# EAGLE design Final188 (EAGLE 9.6.2)
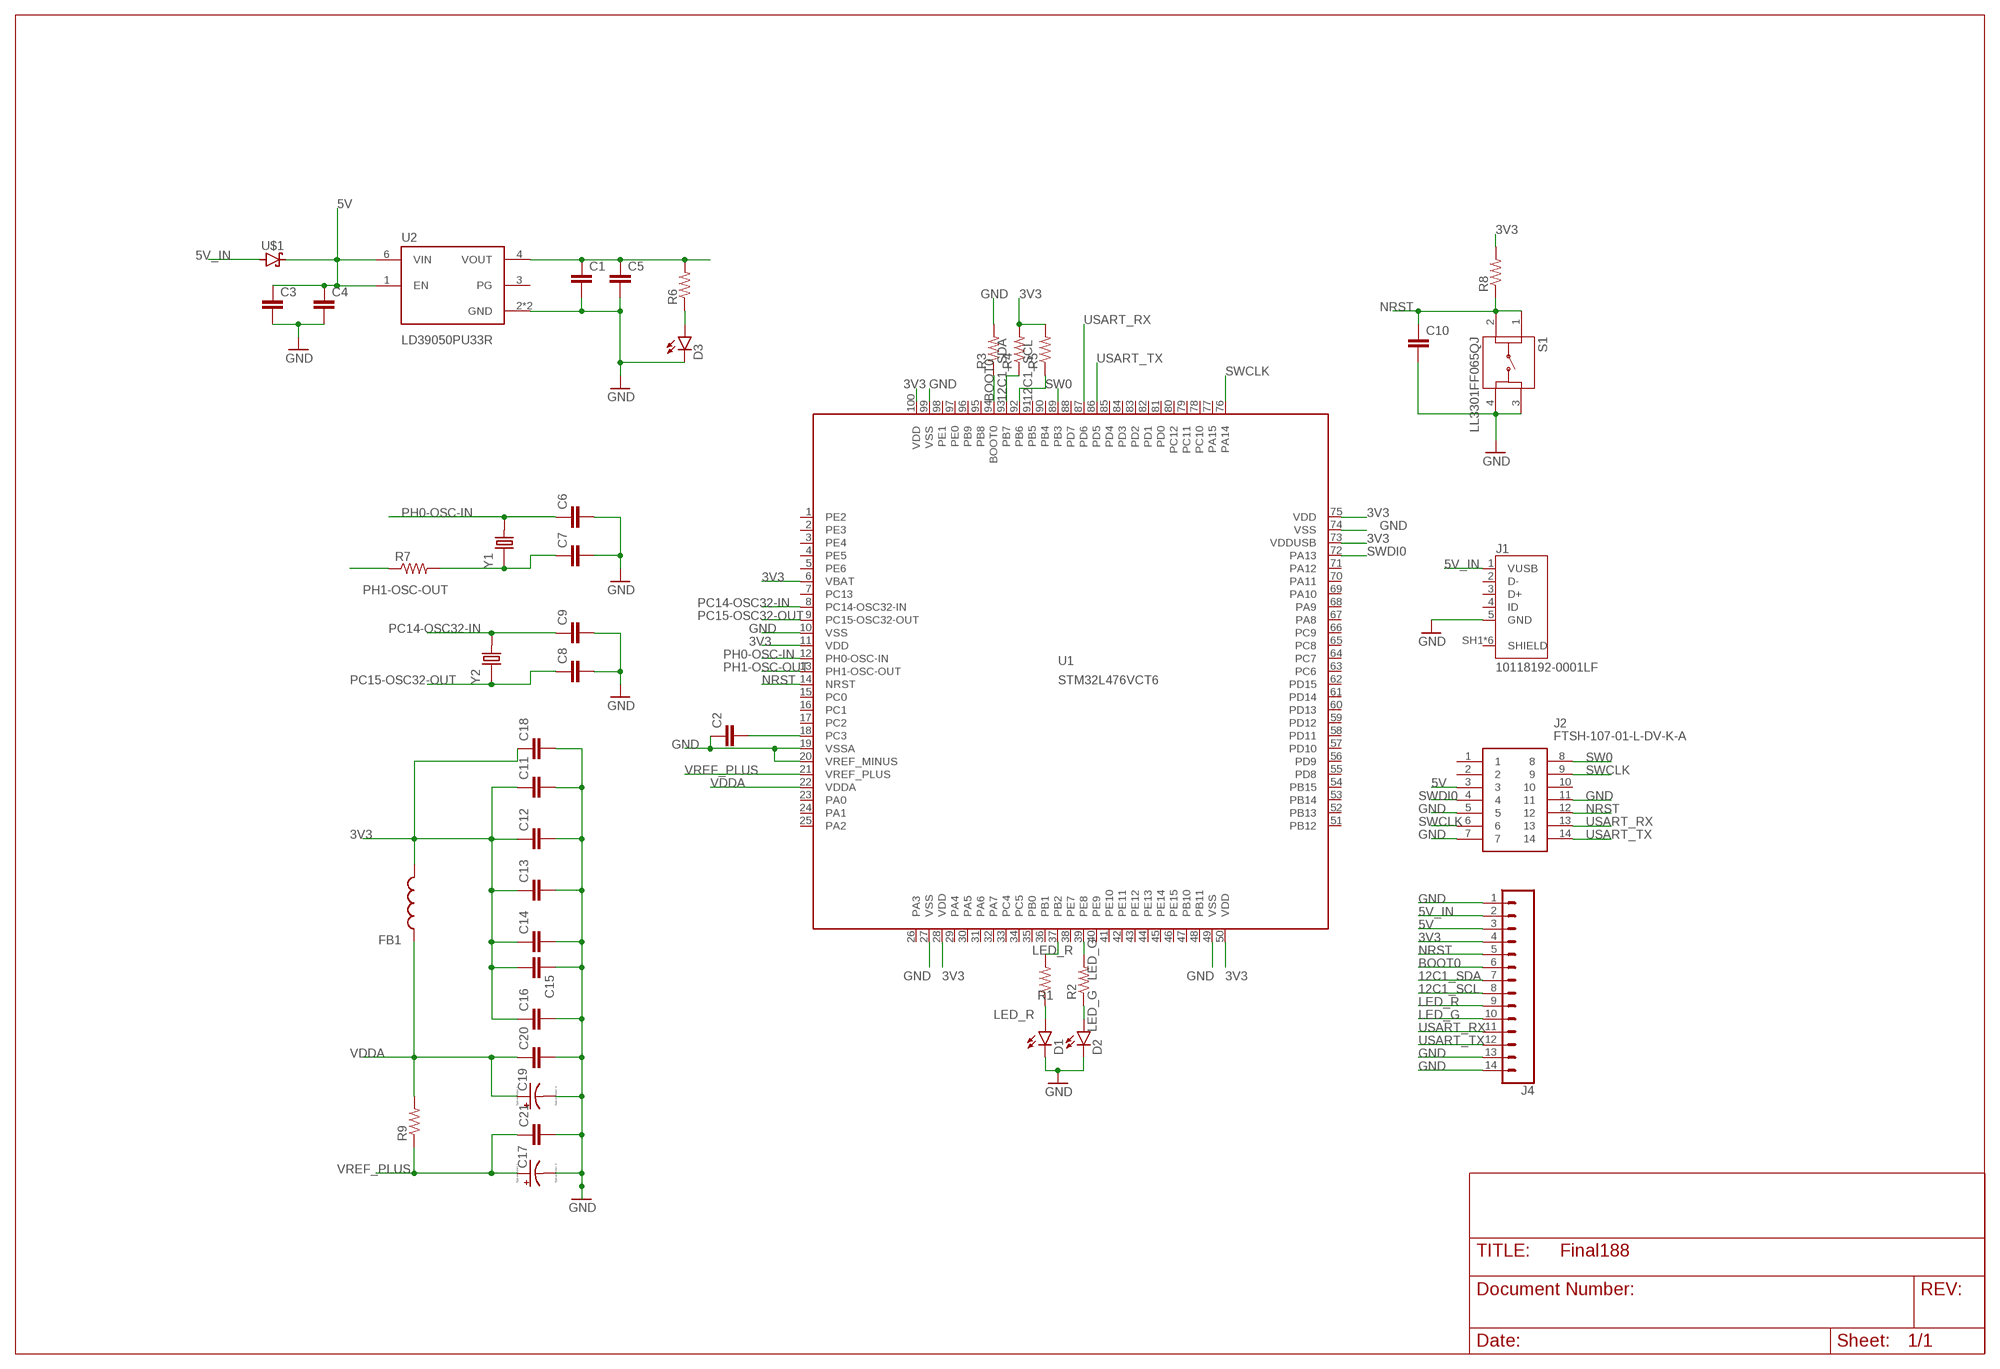
[diagram p0: schematic, sheet 1]

## Parts
C1  CC0603KRX5R7BB105  [CAPC1608X90]
C2  CC0603KRX5R7BB105  [CAPC1608X90]
C3  CC0603KRX5R7BB105  [CAPC1608X90]
C4  CC0402KRX7R7BB104  [CAPC1005X55N]
C5  CC0402KRX7R7BB104  [CAPC1005X55N]
C6  CC0402JRNPO9BN200  [CAPC1005X55N]
C7  CC0402JRNPO9BN200  [CAPC1005X55N]
C8  CC0402CRNPO9BN4R7  [CAPC1005X55N]
C9  CC0402CRNPO9BN4R7  [CAPC1005X55N]
C10  CC0402KRX7R7BB104  [CAPC1005X55N]
C11  CC0402KRX7R7BB104  [CAPC1005X55N]
C12  CC0402KRX7R7BB104  [CAPC1005X55N]
C13  CC0402KRX7R7BB104  [CAPC1005X55N]
C14  CC0402KRX7R7BB104  [CAPC1005X55N]
C15  CC0402KRX7R7BB104  [CAPC1005X55N]
C16  CC0402KRX7R7BB104  [CAPC1005X55N]
C17  TAJA105K016RNJ  [CAPPM3216X180N]
C18  CC0402KRX7R7BB104  [CAPC1005X55N]
C19  TAJA105K016RNJ  [CAPPM3216X180N]
C20  CC0402KRX7R7BB104  [CAPC1005X55N]
C21  CC0402KRX7R7BB104  [CAPC1005X55N]
D1  SML-P12MTT86  [LED_SML-P11UTT86R]
D2  SML-P12MTT86  [LED_SML-P11UTT86R]
D3  SML-P12VTT86  [LED_SML-P11UTT86R]
FB1  BK1608HS601-T  [BEADC1608X95N]
J1  10118192-0001LF  [AMPHENOL_10118192-0001LF]
J2  FTSH-107-01-L-DV-K-A  [FTSH10701LDVKA]
J4  CONN_14  [1X14]
R1  RC0402FR-071KL  [RESC1005X40N]
R2  RC0402FR-071KL  [RESC1005X40N]
R3  RC0402FR-071KL  [RESC1005X40N]
R4  RC0402FR-071KL  [RESC1005X40N]
R5  RC0402FR-071KL  [RESC1005X40N]
R6  RC0402FR-071KL  [RESC1005X40N]
R7  RC0402FR-071KL  [RESC1005X40N]
R8  RC0402FR-0710KL  [RESC1005X40N]
R9  RT0402FRE07220RL  [RESC1005X35N]
S1  LL3301FF065QJ  [LL3301FF065QJ]
U1  STM32L476VCT6  [LQFP100_14X14]
U2  LD39050PU33R  [SON95P300X300X100-7N]
U$1  STPS1L30A  [DIOM5226X223N]
Y1  ABLS-8.000MHZ-B2-T  [XTAL_ABLS-8.000MHZ-B2-T]
Y2  ECS-.327-12.5-12QS-TR  [XTAL_ECS-.327-12.5-12QS-TR]

## Nets
3V3: C11.1 C12.1 C13.1 C14.1 C15.2 C16.1 C18.1 FB1.2 J4.4 R4.2 R5.2 R8.2 U1.6(VBAT) U1.11(VDD) U1.28(VDD) U1.50(VDD) U1.73(VDDUSB) U1.75(VDD) U1.100(VDD)
5V: C3.1 C4.1 J2.3 J4.3 U2.1(EN) U2.6(VIN) U$1.1(C)
5V_IN: J1.1(VUSB) J4.2 U$1.2(A)
12C1_SCL: J4.8 R5.1 U1.92(PB6)
12C1_SDA: J4.7 R4.1 U1.93(PB7)
BOOT0: J4.6 R3.1 U1.94(BOOT0)
GND: C1.2 C2.1 C3.2 C4.2 C5.2 C6.2 C7.2 C8.2 C9.2 C10.2 C11.2 C12.2 C13.2 C14.2 C15.1 C16.2 C17.C(-) C18.2 C19.C(-) C20.2 C21.2 D1.C D2.C D3.C J1.5(GND) J2.5 J2.7 J2.11 J4.1 J4.13 J4.14 R3.2 S1.3 S1.4 U1.10(VSS) U1.19(VSSA) U1.20(VREF_MINUS) U1.27(VSS) U1.49(VSS) U1.74(VSS) U1.99(VSS) U2.2(GND) U2.7(GND)
LED_G: D2.A J4.10 R2.1 R2.2 U1.39(PE8)
LED_R: D1.A J4.9 R1.1 R1.2 U1.37(PB2)
N$8: C2.2 U1.18(PC3)
N$9: C1.1 C5.1 R6.2 U2.4(VOUT)
N$10: C7.1 R7.2 Y1.1
N$11: D3.A R6.1
NRST: C10.1 J2.12 J4.5 R8.1 S1.1 S1.2 U1.14(NRST)
PC14-OSC32-IN: C9.1 U1.8(PC14-OSC32-IN) Y2.2
PC15-OSC32-OUT: C8.1 U1.9(PC15-OSC32-OUT) Y2.1
PH0-OSC-IN: C6.1 U1.12(PH0-OSC-IN) Y1.2
PH1-OSC-OUT: R7.1 U1.13(PH1-OSC-OUT)
SW0: J2.8 U1.89(PB3)
SWCLK: J2.6 J2.9 U1.76(PA14)
SWDI0: J2.4 U1.72(PA13)
USART_RX: J2.13 J4.11 U1.87(PD6)
USART_TX: J2.14 J4.12 U1.86(PD5)
VDDA: C19.A(+) C20.1 FB1.1 R9.2 U1.22(VDDA)
VREF_PLUS: C17.A(+) C21.1 R9.1 U1.21(VREF_PLUS)
Unconnected: J1.2(D-) J1.3(D+) J1.4(ID) J1.SH1(SHIELD) J1.SH2(SHIELD) J1.SH3(SHIELD) J1.SH4(SHIELD) J1.SH5(SHIELD) J1.SH6(SHIELD) J2.1 J2.2 J2.10 U1.1(PE2) U1.2(PE3) U1.3(PE4) U1.4(PE5) U1.5(PE6) U1.7(PC13) U1.15(PC0) U1.16(PC1) U1.17(PC2) U1.23(PA0) U1.24(PA1) U1.25(PA2) U1.26(PA3) U1.29(PA4) U1.30(PA5) U1.31(PA6) U1.32(PA7) U1.33(PC4) U1.34(PC5) U1.35(PB0) U1.36(PB1) U1.38(PE7) U1.40(PE9) U1.41(PE10) U1.42(PE11) U1.43(PE12) U1.44(PE13) U1.45(PE14) U1.46(PE15) U1.47(PB10) U1.48(PB11) U1.51(PB12) U1.52(PB13) U1.53(PB14) U1.54(PB15) U1.55(PD8) U1.56(PD9) U1.57(PD10) U1.58(PD11) U1.59(PD12) U1.60(PD13) U1.61(PD14) U1.62(PD15) U1.63(PC6) U1.64(PC7) U1.65(PC8) U1.66(PC9) U1.67(PA8) U1.68(PA9) U1.69(PA10) U1.70(PA11) U1.71(PA12) U1.77(PA15) U1.78(PC10) U1.79(PC11) U1.80(PC12) U1.81(PD0) U1.82(PD1) U1.83(PD2) U1.84(PD3) U1.85(PD4) U1.88(PD7) U1.90(PB4) U1.91(PB5) U1.95(PB8) U1.96(PB9) U1.97(PE0) U1.98(PE1) U2.3(PG)

## Library data of the parts
C1-C3 = ce-capstone:CC0603KRX5R7BB105: CAPACITOR CERAMIC, 1µF, 10V, X5R, 0603; Dielectric Characteristic:X5R; Capacitance:1µF; Capacitance Tolerance:± 10%; Voltage Rating:16V; Temperature Coefficient:± 15%; Capacitor Case Style:0603; No. of Pins:2; Mounting Type:SMD ;RoHS Compliant: Yes; DESCRIPTION: 1µF ±10% 16V Ceramic Capacitor X5R 0603 _1608 Metric_; DIGI-KEY_PART_NUMBER: 311-1444-1-ND; DIGI-KEY_PURCHASE_URL: https://www.digikey.com/product-detail/en/yageo/CC0603KRX5R7BB105/311-1444-1-ND/2833750?utm_source=snapeda&utm_medium=aggregator&utm_campaign=symbol; MF: Yageo; MP: CC0603KRX5R7BB105; PACKAGE: 0603 Yageo
C4 C5 C10-C16 C18 C20 C21 = ce-capstone:CC0402KRX7R7BB104: .1UF 16V 10% 0402; DESCRIPTION: 0.1µF ±10% 16V Ceramic Capacitor X7R 0402 _1005 Metric_; DIGI-KEY_PART_NUMBER: 311-1338-1-ND; DIGI-KEY_PURCHASE_URL: https://www.digikey.com/product-detail/en/yageo/CC0402KRX7R7BB104/311-1338-1-ND/2103122?utm_source=snapeda&utm_medium=aggregator&utm_campaign=symbol; MF: Yageo; MP: CC0402KRX7R7BB104; PACKAGE: 0402 Yageo
C6 C7 = ce-capstone:CC0402JRNPO9BN200: CAPACITOR CERAMIC 20PF 50V, C0G, 0402; Dielectric Characteristic:C0G / NP0; Capacitance:20pF; Capacitance Tolerance:± 5%; Voltage Rating:50V; Capacitor Case Style:0402; Capacitor Mounting:SMD; DESCRIPTION: 20pF ±5% 50V Ceramic Capacitor C0G, NP0 0402 _1005 Metric_; DIGI-KEY_PART_NUMBER: 311-1417-1-ND; DIGI-KEY_PURCHASE_URL: https://www.digikey.com/product-detail/en/yageo/CC0402JRNPO9BN200/311-1417-1-ND/2833723?utm_source=snapeda&utm_medium=aggregator&utm_campaign=symbol; MF: Yageo; MP: CC0402JRNPO9BN200; PACKAGE: 0402 Yageo
C8 C9 = ce-capstone:CC0402CRNPO9BN4R7: 0402 4.7 pF 50 V ±0.25 pF Tolerance NP0 SMT Multilayer Ceramic Capacitor; DESCRIPTION: 4.7pF ±0.25pF 50V Ceramic Capacitor C0G, NP0 0402 _1005 Metric_; DIGI-KEY_PART_NUMBER: 311-1367-1-ND; DIGI-KEY_PURCHASE_URL: https://www.digikey.com/product-detail/en/yageo/CC0402CRNPO9BN4R7/311-1367-1-ND/2103151?utm_source=snapeda&utm_medium=aggregator&utm_campaign=symbol; MF: Yageo; MP: CC0402CRNPO9BN4R7; PACKAGE: 0402 Yageo
C17 C19 = ce-capstone:TAJA105K016RNJ: Capacitor tantalum TAJ 1206 1uF 16V AVX 1uF SMD Solid MnO2 Tantalum Electrolytic Capacitor, 16 V dc +/-10%, TAJ Series Source: Datasheet <http://www.farnell.com/datasheets/1680476.pdf>; ALLIED_NUMBER: 70474975; ALLIED_PRICE-STOCK: https://www.alliedelec.com/avx-taja105k016r/70474975/; DESCRIPTION: Capacitor tantalum TAJ 1206 1uF 16V AVX 1uF SMD Solid MnO2 Tantalum Electrolytic Capacitor, 16 V dc +/-10%, TAJ Series; HEIGHT: 1.8mm; MANUFACTURER_NAME: AVX; MANUFACTURER_PART_NUMBER: TAJA105K016RNJ; MOUSER_PART_NUMBER: 581-TAJA105K016RNJ; MOUSER_PRICE-STOCK: https://www.mouser.com/Search/Refine.aspx?Keyword=581-TAJA105K016R; RS_PART_NUMBER: 6992804P; RS_PRICE-STOCK: http://uk.rs-online.com/web/p/products/6992804P
D1 D2 = ce-capstone:SML-P12MTT86: SML-P1 Series Red 0402 Clear 60 mcd 2 V Surface Mount PICOLED LED; AVAILABILITY: Unavailable; DESCRIPTION: Green 572nm LED Indication - Discrete 2V 0402 _1006 Metric_; MF: Rohm; MP: SML-P12MTT86; PACKAGE: 0402 Rohm; PRICE: None
D3 = ce-capstone:SML-P12VTT86: SML-P1 Series Red 0402 Clear 60 mcd 2 V Surface Mount PICOLED LED; AVAILABILITY: Unavailable; DESCRIPTION: Red 630nm LED Indication - Discrete 2V 0402 _1006 Metric_; MF: Rohm; MP: SML-P12VTT86; PACKAGE: 0402 Rohm; PRICE: None
FB1 = ce-capstone:BK1608HS601-T: Ferrite Chip Bead(Lead Free) Source: Datasheet <https://www.tai-tech.com.tw/_upload/files/FCM1608-Series.pdf>; DESCRIPTION: Ferrite Chip Bead(Lead Free); HEIGHT: 0.95mm; MANUFACTURER_NAME: Taiyo Yuden; MANUFACTURER_PART_NUMBER: BK1608HS601-T
J1 = ce-capstone:10118192-0001LF: Single Port 5 Contact Horizontal Right Angle Shielded Micro B USB 2.0 Connector; AVAILABILITY: Unavailable; DESCRIPTION: USB - micro B USB 2.0 Receptacle Connector 5 Position Surface Mount, Right Angle; MF: Amphenol ICC; MP: 10118192-0001LF; PACKAGE: None; PRICE: None
J2 = ce-capstone:FTSH-107-01-L-DV-K-A: Headers & Wire Housings .050" Micro Terminal Strip Source: Datasheet <http://suddendocs.samtec.com/prints/ftsh-1xx-xx-xxx-dv-xxx-xxx-mkt.pdf>; DESCRIPTION: Headers & Wire Housings .050" Micro Terminal Strip; HEIGHT: 5.97mm; MANUFACTURER_NAME: SAMTEC; MANUFACTURER_PART_NUMBER: FTSH-107-01-L-DV-K-A; MOUSER_PART_NUMBER: 200-FTSH10701LDVKA; MOUSER_PRICE-STOCK: https://www.mouser.com/Search/Refine.aspx?Keyword=200-FTSH10701LDVKA
J4 = SparkFun-Connectors:CONN_14: Multi connection point. Often used as Generic Header-pin footprint for 0.1 inch spaced/style header connections On any of the 0.1 inch spaced packages, you can populate with these: Break Away Headers - Straight <https://www.sparkfun.com/products/116> (PRT-00116) Break Away Male Headers - Right Angle <https://www.sparkfun.com/products/553> (PRT-00553) Female Headers <https://www.sparkfun.com/products/115> (PRT-00115) Break Away Headers - Machine Pin <https://www.sparkfun.com/products/117> (PRT-00117) Break Away Female Headers - Swiss Machine Pin <https://www.sparkfun.com/products/743> (PRT-00743) For SCREWTERMINALS and SPRING TERMINALS visit here: Screw Terimnals on SparkFun.com <https://www.sparkfun.com/search/results?term=Screw+Terminals> (5mm/3.5mm/2.54mm spacing) This device is also useful as a general connection point to wire up your design to another part of your project. Our various solder wires solder well into these plated through hole pads. Hook-Up Wire - Assortment (Stranded, 22 AWG) <https://www.sparkfun.com/products/11375> (PRT-11375) Hook-Up Wire - Assortment (Solid Core, 22 AWG) <https://www.sparkfun.com/products/11367> (PRT-11367) View the entire wire category on our website here <https://www.sparkfun.com/categories/141> Special notes: Molex polarized connector foot print use with SKU : PRT-08231 with associated crimp pins and housings. 1MM SMD Version SKU: PRT-10208 NOTES ON THE VARIANTS LOCK and LOCK_LONGPADS... This footprint was designed to help hold the alignment of a through-hole component (i.e. 6-pin header) while soldering it into place. You may notice that each hole has been shifted either up or down by 0.005 of an inch from it's more standard position (which is a perfectly straight line). This slight alteration caused the pins (the squares in the middle) to touch the edges of the holes. Because they are alternating, it causes a "brace" to hold the component in place. 0.005 has proven to be the perfect amount of "off-center" position when using our standard breakaway headers. Although looks a little odd when you look at the bare footprint, once you have a header in there, the alteration is very hard to notice. Also,if you push a header all the way into place, it is covered up entirely on the bottom side.
R1-R7 = ce-capstone:RC0402FR-071KL: RES SMD 510 OHM 1% 1/16W 0402; DESCRIPTION: 510 Ohms ±1% 0.063W, 1/16W Chip Resistor 0402 _1005 Metric_ Moisture Resistant Thick Film; DIGI-KEY_PART_NUMBER: 311-510LRCT-ND; DIGI-KEY_PURCHASE_URL: https://www.digikey.com/product-detail/en/yageo/RC0402FR-07510RL/311-510LRCT-ND/729579?utm_source=snapeda&utm_medium=aggregator&utm_campaign=symbol; MF: Yageo; MP: RC0402FR-07510RL; PACKAGE: 1005 Panasonic Electronic Components
R8 = ce-capstone:RC0402FR-0710KL: RES SMD 510 OHM 1% 1/16W 0402; DESCRIPTION: 510 Ohms ±1% 0.063W, 1/16W Chip Resistor 0402 _1005 Metric_ Moisture Resistant Thick Film; DIGI-KEY_PART_NUMBER: 311-510LRCT-ND; DIGI-KEY_PURCHASE_URL: https://www.digikey.com/product-detail/en/yageo/RC0402FR-07510RL/311-510LRCT-ND/729579?utm_source=snapeda&utm_medium=aggregator&utm_campaign=symbol; MF: Yageo; MP: RC0402FR-07510RL; PACKAGE: 1005 Panasonic Electronic Components
R9 = ce-capstone:RT0402FRE07220RL: RES SMD 4.7K OHM 1% 1/16W 0402; DESCRIPTION: 4.7 kOhms ±1% 0.063W, 1/16W Chip Resistor 0402 _1005 Metric_ Thin Film; DIGI-KEY_PART_NUMBER: YAG3347CT-ND; DIGI-KEY_PURCHASE_URL: https://www.digikey.com/product-detail/en/yageo/RT0402FRE074K7L/YAG3347CT-ND/5418052?utm_source=snapeda&utm_medium=aggregator&utm_campaign=symbol; MF: Yageo; MP: RT0402FRE074K7L; PACKAGE: 1005 Yageo
S1 = ce-capstone:LL3301FF065QJ: Pushbutton Switches 50mA 12VDC F065 7.0mm J-Lead Source: Datasheet <https://componentsearchengine.com/Datasheets/1/LL3301FF065QJ.pdf>; DESCRIPTION: Pushbutton Switches 50mA 12VDC F065 7.0mm J-Lead; HEIGHT: 7.3mm; MANUFACTURER_NAME: E-Switch; MANUFACTURER_PART_NUMBER: LL3301FF065QJ; MOUSER_PART_NUMBER: 612-LL3301FF065QJ; MOUSER_PRICE-STOCK: https://www.mouser.com/Search/Refine.aspx?Keyword=612-LL3301FF065QJ
U1 = ce-capstone:STM32L476V*: STM32L476VX LQFP100 Datasheet STM32L476XX <http://www.st.com/content/ccc/resource/technical/document/datasheet/c5/ed/2f/60/aa/79/42/0b/DM00108832.pdf/files/DM00108832.pdf/jcr:content/translations/en.DM00108832.pdf>; FARNELL: 2518171; FLASH: 256kB; SRAM: 128kB
U2 = ce-capstone:LD39050PU33R: LD39050 Series 500 mA 3.3 V Fixed Low Noise LDO Voltage Regulator - DFN-6; AVAILABILITY: Unavailable; DESCRIPTION: Linear Voltage Regulator IC 1 Output 500mA 6-DFN _3x3_; MF: STMicroelectronics; MP: LD39050PU33R; PACKAGE: DFN-6 STMicroelectronics; PRICE: None
U$1 = ce-capstone:STPS1L30A
Y1 = ce-capstone:ABLS-8.000MHZ-B2-T: Crystal 8MHz Â±20ppm (Tol) Â±50ppm (Stability) 18pF FUND 80Ohm 2-Pin HC-49/US SMD T/R; AVAILABILITY: Unavailable; DESCRIPTION: 8MHz ±20ppm Crystal 18pF 80 Ohms HC-49/US; MF: Abracon LLC; MP: ABLS-8.000MHZ-B2; PACKAGE: HC-49/US Abracon LLC; PRICE: None
Y2 = ce-capstone:ECS-.327-12.5-12QS-TR: SMD CRYSTAL 32.768 KHz; AVAILABILITY: Unavailable; DESCRIPTION: 32.768kHz ±20ppm Crystal 12.5pF 90 kOhms 2-SMD, No Lead; MF: ECS Inc.; MP: ECS-.327-12.5-12QS-TR; PACKAGE: SMD-2 ECS International; PRICE: None

## Board
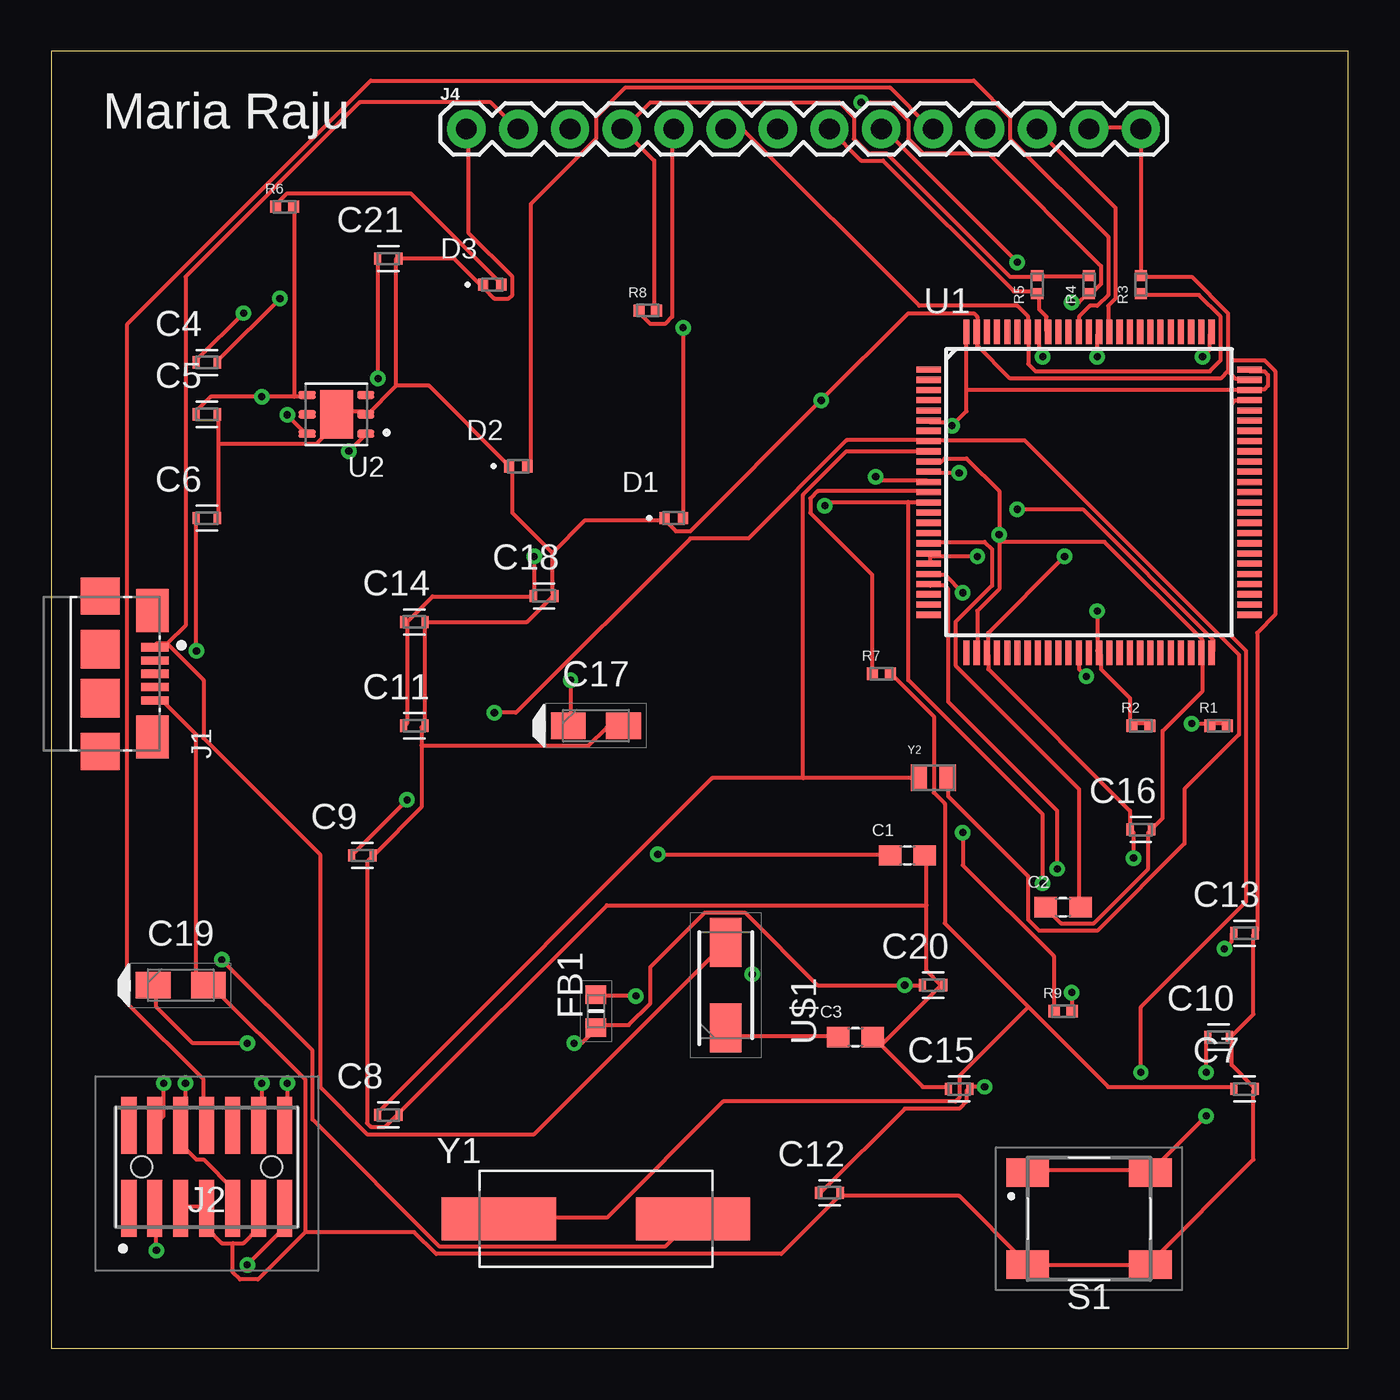
[diagram p1: board, top side]
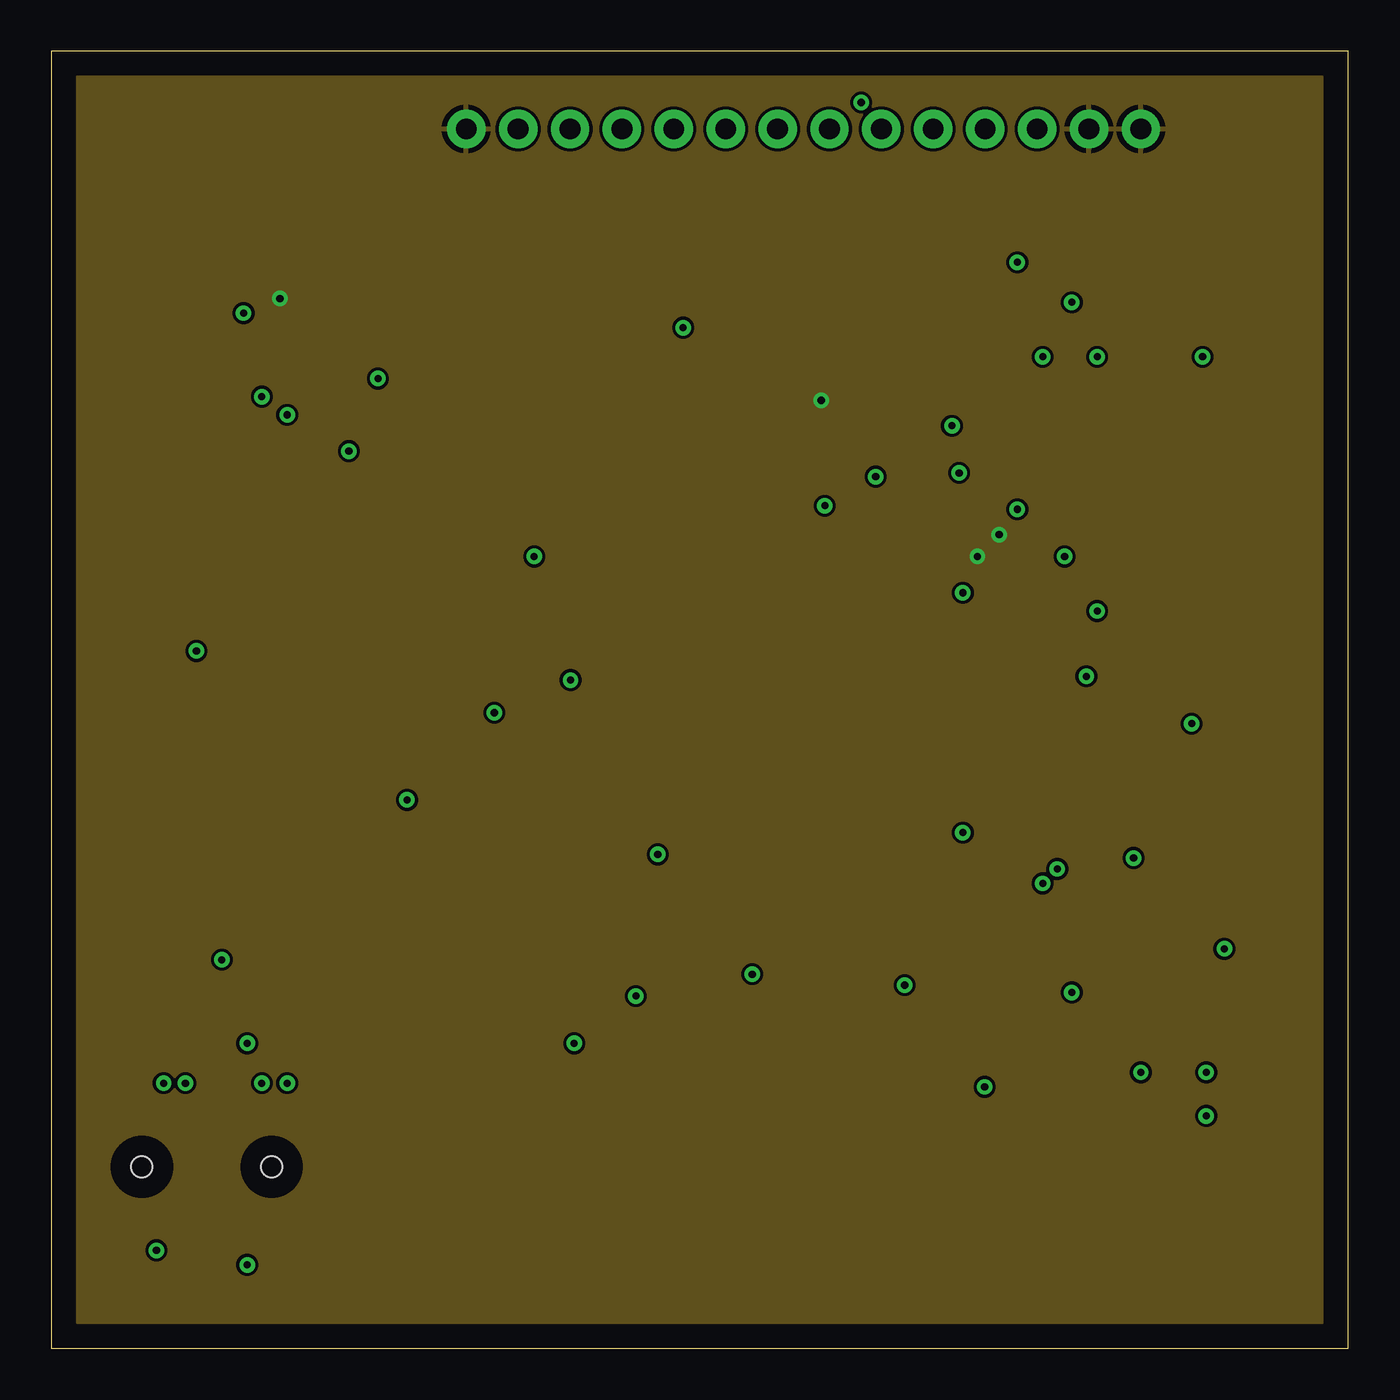
[diagram p2: board, inner layer Route2]
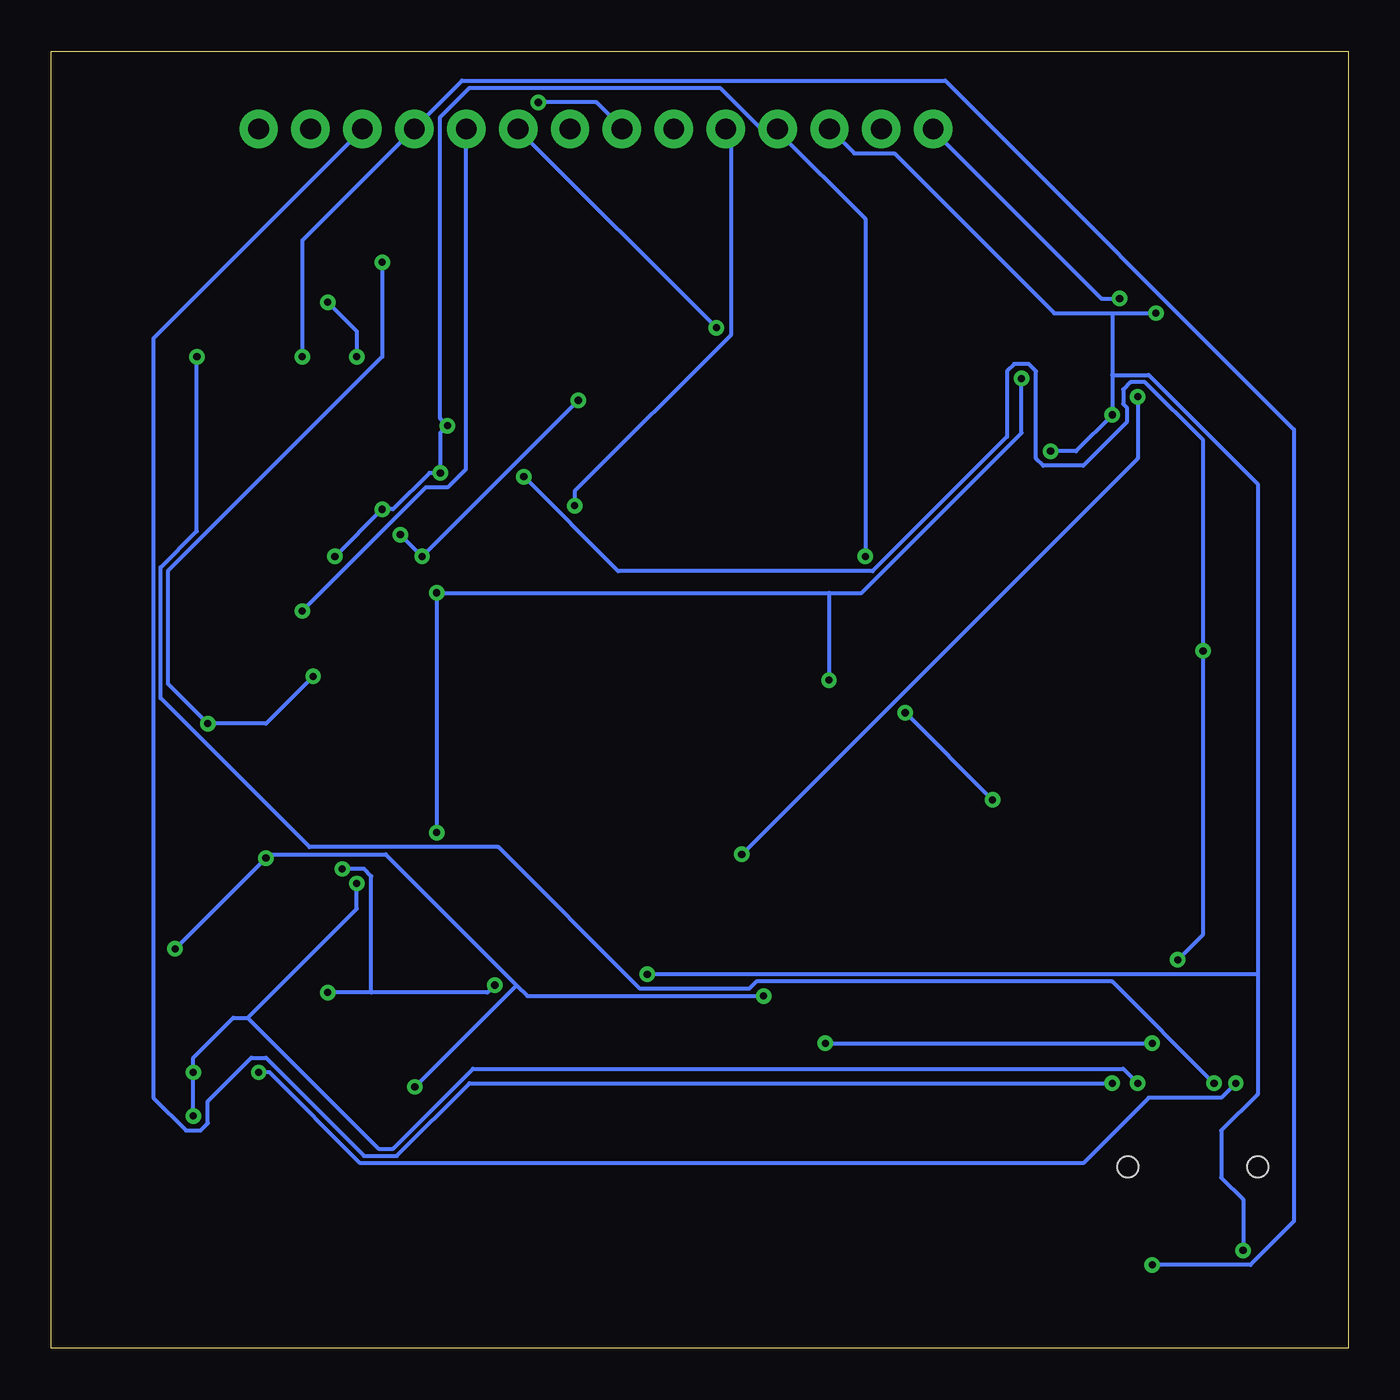
[diagram p3: board, bottom side, seen from below]

Size 63.5 x 63.5 mm. Coordinates in mm from the lower left corner, seen from the top.
Outline: 0,0 63.5,0 63.5,63.5 0,63.5 0,0
Copper layers (1+2*15+16): Top 0.035mm / dielectric 1.5mm / Route2 0.035mm / dielectric 0.15mm / Route15 0.035mm / dielectric 0.2mm / Bottom 0.035mm
Design rules "default *": minimum track width 8mil, minimum drill 0.35mm, track to track 6mil, track to pad 6mil, pad to pad 6mil, via to via 6mil, smd to smd 6mil, copper to edge 40mil, drill to drill 6mil, minimum pad ring 10mil, minimum via ring 8mil, stop-mask expansion 4mil, vias tented up to drill 0mil, thermal gap 10mil

### Footprints (pad centres in the part's own frame; a part is rotated, then mirrored left to right if it is on the bottom)
CAPC1608X90 = smd 1.1 x 1: 1 -0.85,0; 2 0.85,0
CAPC1005X55N = smd 0.35 x 0.6: 1 -0.525,0; 2 0.525,0
CAPPM3216X180N = smd 1.7 x 1.3: A -1.35,0; C 1.35,0
LED_SML-P11UTT86R = smd 0.5 x 0.6: A 0.45,0; C -0.45,0
BEADC1608X95N = smd 0.9 x 1: 1 -0.8,0; 2 0.8,0
AMPHENOL_10118192-0001LF = smd 0.4 x 1.35: 1 -1.3,0; 2 -0.65,0; 3 0,0; 4 0.65,0; 5 1.3,0 | smd 2.1 x 1.6: SH1 -3.1,-0.125; SH2 3.1,-0.125 | smd 1.8 x 1.9: SH3 -3.8,-2.675; SH6 3.8,-2.675 | smd 1.9 x 1.9: SH4 -1.2,-2.675; SH5 1.2,-2.675
FTSH10701LDVKA = smd 0.74 x 2.79: 1 -3.81,-2.035; 2 -3.81,2.035; 3 -2.54,-2.035; 4 -2.54,2.035; 5 -1.27,-2.035; 6 -1.27,2.035; 7 0,-2.035; 8 0,2.035; 9 1.27,-2.035; 10 1.27,2.035; 11 2.54,-2.035; 12 2.54,2.035; 13 3.81,-2.035; 14 3.81,2.035 | hole 1.02: -3.175,0; 3.175,0
1X14 = drill 1.016 pad 1.88: 1 0,0; 2 2.54,0; 3 5.08,0; 4 7.62,0; 5 10.16,0; 6 12.7,0; 7 15.24,0; 8 17.78,0; 9 20.32,0; 10 22.86,0; 11 25.4,0; 12 27.94,0; 13 30.48,0; 14 33.02,0
RESC1005X40N = smd 0.54 x 0.6: 1 -0.432,0; 2 0.432,0
RESC1005X35N = smd 0.56 x 0.6: 1 -0.435,0; 2 0.435,0
LL3301FF065QJ = smd 2.1 x 1.4: 1 -3,2.25; 2 3,2.25; 3 -3,-2.25; 4 3,-2.25
LQFP100_14X14 = smd 1.2 x 0.3: 1 -7.85,6; 2 -7.85,5.5; 3 -7.85,5; 4 -7.85,4.5; 5 -7.85,4; 6 -7.85,3.5; 7 -7.85,3; 8 -7.85,2.5; 9 -7.85,2; 10 -7.85,1.5; 11 -7.85,1; 12 -7.85,0.5; 13 -7.85,0; 14 -7.85,-0.5; 15 -7.85,-1; 16 -7.85,-1.5; 17 -7.85,-2; 18 -7.85,-2.5; 19 -7.85,-3; 20 -7.85,-3.5; 21 -7.85,-4; 22 -7.85,-4.5; 23 -7.85,-5; 24 -7.85,-5.5; 25 -7.85,-6; 51 7.85,-6; 52 7.85,-5.5; 53 7.85,-5; 54 7.85,-4.5; 55 7.85,-4; 56 7.85,-3.5; 57 7.85,-3; 58 7.85,-2.5; 59 7.85,-2; 60 7.85,-1.5; 61 7.85,-1; 62 7.85,-0.5; 63 7.85,0; 64 7.85,0.5; 65 7.85,1; 66 7.85,1.5; 67 7.85,2; 68 7.85,2.5; 69 7.85,3; 70 7.85,3.5; 71 7.85,4; 72 7.85,4.5; 73 7.85,5; 74 7.85,5.5; 75 7.85,6 | smd 0.3 x 1.2: 26 -6,-7.85; 27 -5.5,-7.85; 28 -5,-7.85; 29 -4.5,-7.85; 30 -4,-7.85; 31 -3.5,-7.85; 32 -3,-7.85; 33 -2.5,-7.85; 34 -2,-7.85; 35 -1.5,-7.85; 36 -1,-7.85; 37 -0.5,-7.85; 38 0,-7.85; 39 0.5,-7.85; 40 1,-7.85; 41 1.5,-7.85; 42 2,-7.85; 43 2.5,-7.85; 44 3,-7.85; 45 3.5,-7.85; 46 4,-7.85; 47 4.5,-7.85; 48 5,-7.85; 49 5.5,-7.85; 50 6,-7.85; 76 6,7.85; 77 5.5,7.85; 78 5,7.85; 79 4.5,7.85; 80 4,7.85; 81 3.5,7.85; 82 3,7.85; 83 2.5,7.85; 84 2,7.85; 85 1.5,7.85; 86 1,7.85; 87 0.5,7.85; 88 0,7.85; 89 -0.5,7.85; 90 -1,7.85; 91 -1.5,7.85; 92 -2,7.85; 93 -2.5,7.85; 94 -3,7.85; 95 -3.5,7.85; 96 -4,7.85; 97 -4.5,7.85; 98 -5,7.85; 99 -5.5,7.85; 100 -6,7.85
SON95P300X300X100-7N = smd 0.84 x 0.4: 1 -1.435,0.95; 2 -1.435,0; 3 -1.435,-0.95; 4 1.435,-0.95; 5 1.435,0; 6 1.435,0.95 | smd 1.625 x 2.365: 7 0,0
DIOM5226X223N = smd 2.4 x 1.55: 1 -2.1,0; 2 2.1,0
XTAL_ABLS-8.000MHZ-B2-T = smd 5.6 x 2.1: 1 -4.75,0; 2 4.75,0
XTAL_ECS-.327-12.5-12QS-TR = smd 0.8 x 1.3: 1 -0.7,0; 2 0.7,0

### Placement (x,y rotation side)
C1  41.91,24.13 0 top
C2  49.53,21.59 0 top
C3  39.37,15.24 0 top
C4  7.62,48.26 0 top
C5  7.62,45.72 0 top
C6  7.62,40.64 0 top
C7  58.42,12.7 0 top
C8  16.51,11.43 0 top
C9  15.24,24.13 0 top
C10  57.15,15.24 0 top
C11  17.78,30.48 0 top
C12  38.1,7.62 0 top
C13  58.42,20.32 0 top
C14  17.78,35.56 0 top
C15  44.45,12.7 0 top
C16  53.34,25.4 0 top
C17  26.67,30.48 0 top
C18  24.13,36.83 0 top
C19  6.35,17.78 0 top
C20  43.18,17.78 0 top
C21  16.51,53.34 0 top
D1  30.48,40.64 0 top
D2  22.86,43.18 0 top
D3  21.59,52.07 0 top
FB1  26.67,16.51 90 top
J1  5.08,33.02 270 top
J2  7.62,8.89 0 top
J4  20.32,59.69 0 top
R1  57.15,30.48 0 top
R2  53.34,30.48 0 top
R3  53.34,52.07 90 top
R4  50.8,52.07 90 top
R5  48.26,52.07 90 top
R6  11.43,55.88 0 top
R7  40.64,33.02 0 top
R8  29.21,50.8 0 top
R9  49.53,16.51 0 top
S1  50.8,6.35 0 top
U1  50.8,41.91 0 top
U2  13.97,45.72 180 top
U$1  33.02,17.78 90 top
Y1  26.67,6.35 0 top
Y2  43.18,27.94 0 top

### Tracks (layer width: path | path; a pad name or v marks a point on that pad's centre or on a via)
3V3  (via drill 0.35)
  Top 0.203: 17.42,35.56 17.42,30.58 C11.1 | 17.42,35.56 18.67,36.8 23.47,36.8 C18.1 23.65,36.98 v23.65,38.76 | 17.42,35.56 C14.1 | R4.2 50.67,52.45 48.36,52.45 R5.2 48.18,52.45 46.94,52.45 40.89,58.5 40.01,58.5 39.29,59.21 39.29,60.27 38.58,60.98 29.34,60.98 28.09,59.74 J4.4 28.09,59.56 29.52,58.14 29.52,50.85 R8.2 | U1.75 58.67,47.83 59.38,47.83 59.56,47.65 59.56,47.12 59.38,46.94 58.67,46.94 U1.73 58.5,46.94 44.81,46.94 | v44.45,42.85 43.03,42.85 U1.11 | U1.6 43.03,45.34 43.74,45.34 43.92,45.16 v44.09,45.16 44.81,45.87 44.81,46.94 | v47.3,41.07 50.49,41.07 56.9,34.67 56.9,34.14 U1.50 | 44.81,46.94 44.81,49.61 U1.100 | C12.1 37.69,7.64 41.78,11.73 44.45,11.73 44.81,12.09 44.81,12.62 C15.2 44.98,12.8 v45.7,12.8 | v57.43,19.56 57.78,19.91 57.78,20.27 C13.1 | v52.98,24 52.98,25.25 C16.1 52.81,25.43 52.81,26.31 45.87,33.25 45.87,33.96 U1.28 45.87,34.14 45.87,35.03 v49.61,38.76 | v28.63,17.25 26.67,17.25 FB1.2
  Bottom 0.203: v23.65,38.76 23.65,55.3 27.91,59.56 J4.4 28.09,59.74 28.8,59.74 30.76,61.7 43.03,61.7 44.45,60.27 44.45,45.52 v44.09,45.16 44.45,44.81 v44.45,42.85 44.98,42.85 46.76,41.07 v47.3,41.07 v49.61,38.76 | v57.43,19.56 v52.98,24 52.81,24.18 47.12,24.18 40.72,17.78 | v28.63,17.25 40.18,17.25 40.72,17.78 | 40.72,17.78 v45.7,12.8
5V  (via drill 0.35)
  Top 0.203: 34.31,15.29 33.43,15.29 33.07,15.65 U$1.1 | 34.31,15.29 38.41,15.29 C3.1 | v9.42,50.67 7.11,48.36 C4.1 | v11.56,45.7 12.45,44.81 U2.6 | v14.58,43.92 15.29,44.63 U2.1 | v5.16,4.8 5.16,6.76 J2.3 | v34.31,18.31 34.31,15.29
  Bottom 0.203: 11.56,50.67 14.4,50.67 22.23,58.5 24.18,58.5 25.25,59.56 J4.3 | 11.56,50.67 v9.42,50.67 | 11.56,50.67 11.56,47.65 | 11.56,47.65 v11.56,45.7 13.34,43.92 v14.58,43.92 | v5.16,4.8 5.16,7.29 6.22,8.36 6.22,10.67 4.45,12.45 4.45,18.31 | 4.45,18.31 4.45,42.32 9.78,47.65 11.56,47.65 | 4.45,18.31 v34.31,18.31
5V_IN
  Top 0.203: 5.69,34.49 5.16,34.49 J1.1 5.69,34.49 | 5.69,34.49 6.58,35.38 6.58,52.45 15.11,60.98 21.51,60.98 22.76,59.74 J4.2 | 5.69,34.49 7.47,32.72 7.47,29.87 13.16,24.18 13.16,12.8 15.47,10.49 23.65,10.49 32.89,19.74 U$1.2
12C1_SCL
  Top 0.203: U1.92 48.72,49.78 48.72,50.49 48.36,50.85 48.36,51.56 R5.1 48.18,51.74 47.12,51.74 40.72,58.14 39.65,58.14 J4.8
12C1_SDA  (via drill 0.35)
  Top 0.203: v39.65,60.98 41.07,60.98 41.96,60.1 41.96,59.21 42.67,58.5 45.87,58.5 51.38,52.98 51.38,52.09 51.03,51.74 50.85,51.74 R4.1 50.67,51.56 50.32,51.21 v49.96,51.21 | v48.54,48.54 48.36,48.72 48.36,49.61 U1.93
  Bottom 0.203: v39.65,60.98 36.8,60.98 35.56,59.74 J4.7 | v48.54,48.54 48.54,49.78 v49.96,51.21
BOOT0
  Top 0.203: R3.1 53.34,51.56 56.19,51.56 57.25,50.49 57.25,48.36 56.72,47.83 48.18,47.83 47.83,48.18 47.83,49.61 U1.94 47.83,49.78 47.83,50.49 47.3,51.03 42.49,51.03 33.96,59.56 33.07,59.56 J4.6
GND  (via drill 0.35)
  Top 0.203: J2.5 6.4,6.93 7.47,6.93 J2.7 7.64,6.76 7.64,5.87 8.36,5.16 8.89,5.16 | 8.89,5.16 9.42,5.16 10.13,5.87 10.13,6.76 J2.11 | J1.5 5.16,31.65 5.51,31.65 7.11,30.05 7.11,18.31 7.64,17.78 C19.C 7.82,17.78 12.45,13.16 12.45,5.69 | 8.89,5.16 8.89,3.73 9.25,3.38 10.13,3.38 12.45,5.69 | 12.45,5.69 17.78,5.69 18.85,4.62 35.74,4.62 38.58,7.47 C12.2 38.76,7.47 44.45,7.47 47.65,4.27 S1.3 47.83,4.09 53.7,4.09 S1.4 53.87,4.27 58.85,9.25 58.85,12.62 C7.2 58.85,12.8 57.78,13.87 57.78,15.11 C10.2 57.78,15.29 58.85,16.36 58.85,20.27 C13.2 59.03,20.45 59.03,35.03 59.92,35.92 59.92,47.83 59.38,48.36 57.61,48.36 | 43.03,38.76 43.03,38.41 U1.20 | 46.41,39.47 46.41,37.16 45.34,36.09 45.34,34.14 U1.27 | U1.10 43.03,43.38 43.56,43.38 43.74,43.56 44.81,43.56 46.41,41.96 v46.41,39.83 46.41,39.47 | v45.34,38.76 43.03,38.76 | 43.03,38.76 U1.19 | C2.1 48.72,21.51 49.43,20.8 51.03,20.8 53.7,23.47 53.7,25.25 C16.2 53.87,25.43 54.41,25.96 54.41,30.23 56.36,32.18 56.36,33.96 U1.49 56.36,34.14 56.36,34.67 51.56,39.47 46.41,39.47 | 57.61,47.83 57.96,47.47 58.5,47.47 U1.74 | 57.61,48.36 57.61,50.67 55.83,52.45 53.34,52.45 R3.2 J4.14 53.34,59.74 50.85,59.74 J4.13 | 57.61,48.36 57.61,47.83 | 57.61,47.83 57.25,47.47 46.94,47.47 45.34,49.07 45.34,49.61 U1.99 45.34,49.78 45.34,50.49 45.16,50.67 41.96,50.67 v37.69,46.41 31.29,40.01 30.58,40.01 30.05,40.54 D1.C 29.87,40.54 26.14,40.54 24.54,38.94 | v11.2,51.38 8.18,48.36 C4.2 | 8.18,44.27 8.18,45.7 C5.2 | 8.18,44.27 8.18,40.72 C6.2 | 8.18,44.27 12.98,44.27 13.87,45.16 13.87,45.7 U2.7 14.05,45.87 15.29,45.87 U2.2 15.47,45.7 16.89,47.12
  Top 0.203: 16.89,47.12 16.89,53.34 C21.2 19.74,53.34 20.98,52.09 D3.C 21.16,51.92 21.69,51.38 22.4,51.38 22.58,51.56 22.58,52.45 20.45,54.59 20.45,59.56 J4.1 | 40.54,14.94 40.36,15.11 C3.2 40.54,14.94 | 40.54,14.94 42.67,12.8 43.92,12.8 C15.1 | 43.56,17.78 40.72,14.94 40.54,14.94 | 42.85,21.69 42.85,18.49 43.56,17.78 | 42.85,21.69 42.85,24 C1.2 | 43.56,17.78 C20.2 | 18.14,29.52 18.14,30.4 C11.2 18.31,30.58 18.31,35.56 | 18.14,29.52 18.14,26.49 15.82,24.18 C9.2 15.65,24 15.47,23.82 15.47,11.02 15.65,10.85 16.36,10.85 16.89,11.38 C8.2 17.07,11.56 27.2,21.69 42.85,21.69 | 18.31,35.56 23.29,35.56 24.54,36.8 C18.2 24.54,36.98 24.54,38.94 | 18.31,35.56 C14.2 | 24.54,38.94 22.58,40.89 22.58,43.03 D2.C 22.4,43.2 18.49,47.12 16.89,47.12 | 18.14,29.52 26.31,29.52 27.2,30.4 27.91,30.4 C17.C
  Bottom 0.203: v46.41,39.83 v45.34,38.76 v37.69,46.41 | v11.2,51.38 12.09,51.38 20.27,59.56 J4.1
  pour Route2: 1.27,62.23 1.27,1.27 62.23,1.27 62.23,60.96 62.23,62.23
LED_G  (via drill 0.35)
  Top 0.203: R2.2 53.7,30.58 52.98,30.58 R2.1 52.81,30.58 52.81,31.83 51.38,33.25 51.38,33.96 U1.39 51.21,34.14 v51.21,36.09 | D2.A 23.47,43.2 23.47,56.01 26.67,59.21 26.67,60.27 28.09,61.7 41.07,61.7 43.03,59.74 J4.10
  Bottom 0.203: v51.21,36.09 45.16,42.14 44.09,42.14 43.2,43.03 43.2,59.56 J4.10
LED_R  (via drill 0.35)
  Top 0.203: R1.2 57.43,30.58 56.72,30.58 R1.1 56.54,30.58 v55.83,30.58 | v50.67,32.89 50.32,33.25 50.32,33.96 U1.37 | v30.94,49.96 30.94,40.72 D1.A | v47.3,53.16 40.72,59.74 J4.9
  Bottom 0.203: v50.67,32.89 52.98,30.58 v55.83,30.58 57.78,32.54 57.78,38.05 47.3,48.54 v47.3,53.16 | v30.94,49.96 40.54,59.56 J4.9
N$8
  Top 0.203: C2.2 50.32,21.69 50.32,27.38 44.27,33.43 44.27,35.56 46.05,37.34 46.05,39.12 45.7,39.47 43.03,39.47 U1.18
N$9  (via drill 0.35)
  Top 0.203: 11.91,46.58 12.45,46.58 U2.4 | 11.91,46.58 v10.31,46.58 7.82,46.58 7.11,45.87 C5.1 | 11.91,46.58 11.91,55.83 R6.2 | v29.69,24.18 40.89,24.18 C1.1
  Bottom 0.203: v29.69,24.18 10.31,43.56 v10.31,46.58
N$10
  Top 0.203: 47.83,16.71 43.74,20.8 43.74,26.67 43.2,27.2 43.2,30.94 41.25,32.89 R7.2 | 47.83,16.71 51.74,12.8 57.78,12.8 C7.1 | 47.83,16.71 44.45,13.34 44.45,12.27 44.27,12.09 32.89,12.09 27.2,6.4 22.05,6.4 Y1.1
N$11
  Top 0.203: D3.A 21.87,52.09 21.87,52.27 17.6,56.54 11.56,56.54 11.02,56.01 R6.1
NRST  (via drill 0.35)
  Top 0.203: R8.1 28.8,50.67 29.34,50.14 30.05,50.14 30.4,50.49 30.4,59.56 J4.5 | 41.96,41.43 38.05,41.43 v37.87,41.25 | 41.96,41.43 42.85,41.43 U1.14 | v56.54,13.51 56.54,15.11 C10.1 | v56.54,11.38 53.87,8.71 S1.2 53.7,8.71 47.83,8.71 S1.1 | v10.31,12.98 10.31,11.02 J2.12 | 41.96,41.43 41.96,32.72 48.54,26.14 v48.54,22.76
  Bottom 0.203: v37.87,41.25 37.87,41.96 30.23,49.61 30.23,59.38 30.4,59.56 J4.5 | v56.54,11.38 v56.54,13.51 56.54,14.22 54.59,16.18 53.87,16.18 | v10.31,12.98 11.02,13.69 42.85,13.69 46.76,9.78 47.47,9.78 53.87,16.18 | v48.54,22.76 48.54,21.51 53.87,16.18
PC14-OSC32-IN  (via drill 0.35)
  Top 0.203: v17.42,26.85 14.76,24.18 C9.1 | v21.69,31.11 22.76,31.11 31.29,39.65 34.14,39.65 38.94,44.45 42.85,44.45 U1.8 43.03,44.45 47.65,44.45 58.14,33.96 58.14,30.05 55.47,27.38 55.47,24.71 51.21,20.45 48.36,20.45 47.83,20.98 47.83,23.11 43.92,27.03 43.92,27.91 Y2.2
  Bottom 0.203: v21.69,31.11 v17.42,26.85
PC15-OSC32-OUT
  Top 0.203: 36.8,27.91 42.32,27.91 Y2.1 | 36.8,27.91 32.36,27.91 16,11.56 C8.1 | 36.8,27.91 36.8,41.78 38.94,43.92 42.85,43.92 U1.9
PH0-OSC-IN  (via drill 0.35)
  Top 0.203: v7.11,34.14 7.11,40.54 C6.1 | v8.36,19.02 12.8,14.58 12.8,11.2 19.02,4.98 30.05,4.98 31.29,6.22 Y1.2 | v40.36,42.67 40.54,42.49 42.85,42.49 U1.12
  Bottom 0.203: v8.36,19.02 7.11,20.27 v7.11,34.14 7.11,44.45 9.96,47.3 10.67,47.3 11.02,46.94 11.02,46.23 10.85,46.05 10.85,45.34 12.98,43.2 14.94,43.2 15.29,43.56 15.29,47.83 15.65,48.18 16.36,48.18 16.71,47.83 16.71,44.63 23.29,38.05 35.74,38.05 v40.36,42.67
PH1-OSC-OUT
  Top 0.203: R7.1 40.18,33.07 40.18,37.87 37.16,40.89 37.16,41.6 37.52,41.96 42.85,41.96 U1.13
SW0
  Top 0.203: U1.89 50.32,49.78 50.32,50.49 50.85,51.03 51.21,51.03 51.74,51.56 51.74,54.41 46.94,59.21 46.94,60.27 45.16,62.05 15.65,62.05 3.73,50.14 3.73,16.89 7.47,13.16 7.47,11.02 J2.8
SWCLK  (via drill 0.35)
  Top 0.203: v56.36,48.54 56.72,48.9 56.72,49.61 U1.76 | v6.58,12.98 6.58,11.2 6.4,11.02 J2.6 6.4,10.85 6.4,9.96 7.11,9.25 7.47,9.25 8.89,7.82 J2.9
  Bottom 0.203: v56.36,48.54 56.36,40.01 58.14,38.23 58.14,31.83 50.85,24.54 41.6,24.54 34.67,17.6 29.34,17.6 28.98,17.96 11.56,17.96 v6.58,12.98
SWDI0  (via drill 0.35)
  Top 0.203: v53.34,13.51 53.34,16.71 58.5,21.87 58.5,34.14 57.78,34.85 57.78,46.23 57.96,46.41 58.5,46.41 U1.72 | v5.51,12.98 5.51,11.38 5.16,11.02 J2.4
  Bottom 0.203: v53.34,13.51 52.81,13.51 48.36,9.07 12.98,9.07 9.78,12.27 6.22,12.27 v5.51,12.98
USART_RX  (via drill 0.35)
  Top 0.203: v51.21,48.54 51.21,49.61 U1.87 | v9.6,4.09 11.38,5.87 11.38,6.76 J2.13
  Bottom 0.203: v51.21,48.54 51.21,54.23 45.87,59.56 J4.11 45.7,59.74 43.38,62.05 19.74,62.05 2.67,44.98 2.67,6.22 4.8,4.09 v9.6,4.09
USART_TX  (via drill 0.35)
  Top 0.203: U1.86 51.74,49.78 51.74,51.03 52.09,51.38 52.09,55.83 48.36,59.56 J4.12 | v11.56,12.98 11.56,11.02 J2.14
  Bottom 0.203: v11.56,12.98 43.03,12.98 46.58,9.42 48.18,9.42 52.98,14.22 53.7,14.22 55.83,12.09 55.83,11.02 56.19,10.67 56.9,10.67 58.5,12.27 58.5,49.43 48.36,59.56 J4.12
VDDA  (via drill 0.35)
  Top 0.203: C20.1 v41.78,17.78 37.52,17.78 33.96,21.34 32,21.34 29.34,18.67 29.34,16.89 28.27,15.82 26.67,15.82 FB1.1 26.67,15.65 25.96,14.94 v25.6,14.94 | v49.96,17.42 49.96,16.54 R9.2 | v49.25,23.47 49.25,26.31 43.92,31.65 43.92,37.16 43.74,37.34 43.03,37.34 U1.22 | v9.6,14.94 6.93,14.94 5.16,16.71 5.16,17.78 C19.A
  Bottom 0.203: 47.83,17.42 42.14,17.42 v41.78,17.78 | 47.83,17.42 v49.96,17.42 | v49.25,23.47 48.18,23.47 47.83,23.11 47.83,17.42 | v25.6,14.94 v9.6,14.94
VREF_PLUS  (via drill 0.35)
  Top 0.203: v44.63,25.25 44.63,23.65 49.07,19.2 49.07,16.54 R9.1 | v44.63,36.98 43.74,37.87 43.03,37.87 U1.21 | v16,47.47 16,53.34 C21.1 | v25.43,32.72 25.43,30.58 C17.A
  Bottom 0.203: v44.63,25.25 v44.63,36.98 25.43,36.98 | v16,47.47 16,44.81 23.82,36.98 25.43,36.98 | 25.43,36.98 v25.43,32.72

### Text on the board
tPlace: Maria Raju